# Altium project BlueSat_FlatSat.PrjPCB (part 1 of 2)
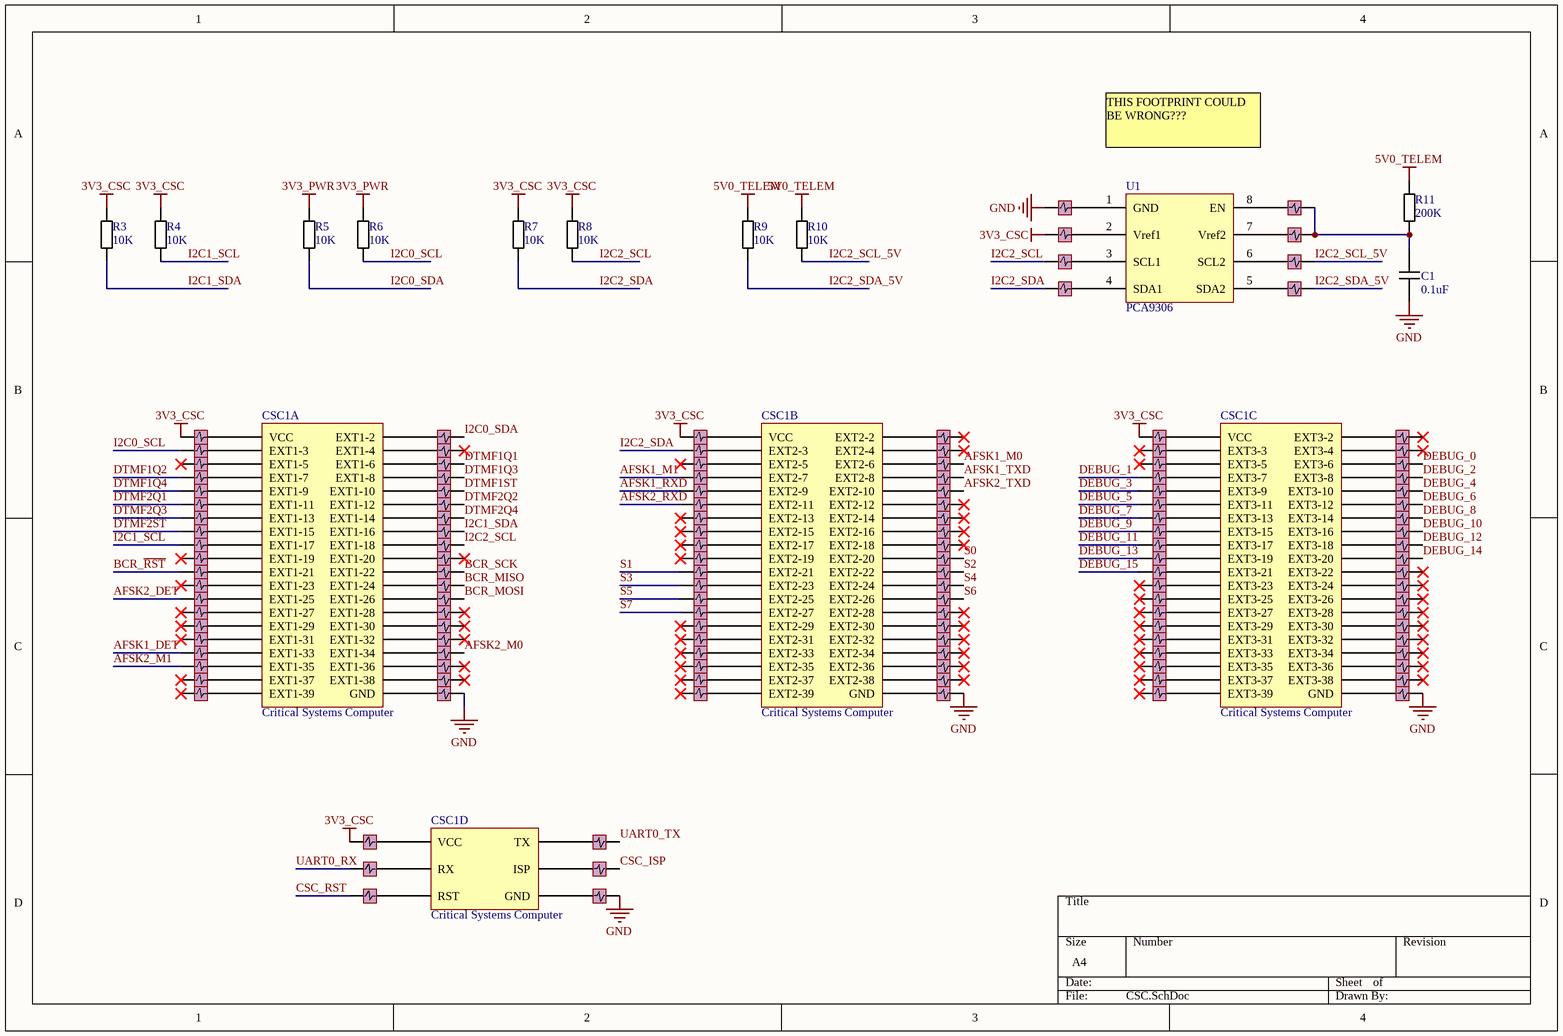
[diagram p0: CSC.SchDoc]
7 sheets, 787 parts. Net scope: global (net labels, ports and power ports of the same name join across sheets).
Board files: FLATSAT.PcbDoc, CSC_TEMP.PcbDoc, BBONE_TEMP.PcbDoc, COMMS_TEMP.PcbDoc, PWR_REG_TEMP.PcbDoc, PWR_GEN_TEMP.PcbDoc, LAYOUT_TEMP.PcbDoc
Sheets:
  CSC.SchDoc
  BBONE.SchDoc
  COMMS.SchDoc
  PWR_GEN.SchDoc
  PWR_REG.SchDoc
  CONNECTORS.SchDoc
  LED_INDICATORS.SchDoc

## Sheet CSC.SchDoc
size A4; DocumentNumber: 1; SheetNumber: 1; SheetTotal: 6

### Parts
C1  value 0.1uF  [6-0805_M]  (hidden comment: 0805 Cap)
CSC1  Critical Systems Computer  [CSC]  (parts A,B,C,D of 4)
P203  Jumper_Filter  [Jumper_filter]  (value not drawn)
P204  Jumper_Filter  [Jumper_filter]  (value not drawn)
P205  Jumper_Filter  [Jumper_filter]  (value not drawn)
P206  Jumper_Filter  [Jumper_filter]  (value not drawn)
P207  Jumper_Filter  [Jumper_filter]  (value not drawn)
P208  Jumper_Filter  [Jumper_filter]  (value not drawn)
P209  Jumper_Filter  [Jumper_filter]  (value not drawn)
P210  Jumper_Filter  [Jumper_filter]  (value not drawn)
P211  Jumper_Filter  [Jumper_filter]  (value not drawn)
P212  Jumper_Filter  [Jumper_filter]  (value not drawn)
P213  Jumper_Filter  [Jumper_filter]  (value not drawn)
P214  Jumper_Filter  [Jumper_filter]  (value not drawn)
P215  Jumper_Filter  [Jumper_filter]  (value not drawn)
P216  Jumper_Filter  [Jumper_filter]  (value not drawn)
P217  Jumper_Filter  [Jumper_filter]  (value not drawn)
P218  Jumper_Filter  [Jumper_filter]  (value not drawn)
P219  Jumper_Filter  [Jumper_filter]  (value not drawn)
P220  Jumper_Filter  [Jumper_filter]  (value not drawn)
P221  Jumper_Filter  [Jumper_filter]  (value not drawn)
P222  Jumper_Filter  [Jumper_filter]  (value not drawn)
P223  Jumper_Filter  [Jumper_filter]  (value not drawn)
P224  Jumper_Filter  [Jumper_filter]  (value not drawn)
P225  Jumper_Filter  [Jumper_filter]  (value not drawn)
P226  Jumper_Filter  [Jumper_filter]  (value not drawn)
P227  Jumper_Filter  [Jumper_filter]  (value not drawn)
P228  Jumper_Filter  [Jumper_filter]  (value not drawn)
P229  Jumper_Filter  [Jumper_filter]  (value not drawn)
P230  Jumper_Filter  [Jumper_filter]  (value not drawn)
P231  Jumper_Filter  [Jumper_filter]  (value not drawn)
P232  Jumper_Filter  [Jumper_filter]  (value not drawn)
P233  Jumper_Filter  [Jumper_filter]  (value not drawn)
P234  Jumper_Filter  [Jumper_filter]  (value not drawn)
P235  Jumper_Filter  [Jumper_filter]  (value not drawn)
P236  Jumper_Filter  [Jumper_filter]  (value not drawn)
P237  Jumper_Filter  [Jumper_filter]  (value not drawn)
P238  Jumper_Filter  [Jumper_filter]  (value not drawn)
P239  Jumper_Filter  [Jumper_filter]  (value not drawn)
P240  Jumper_Filter  [Jumper_filter]  (value not drawn)
P241  Jumper_Filter  [Jumper_filter]  (value not drawn)
P242  Jumper_Filter  [Jumper_filter]  (value not drawn)
P243  Jumper_Filter  [Jumper_filter]  (value not drawn)
P244  Jumper_Filter  [Jumper_filter]  (value not drawn)
P245  Jumper_Filter  [Jumper_filter]  (value not drawn)
P246  Jumper_Filter  [Jumper_filter]  (value not drawn)
P247  Jumper_Filter  [Jumper_filter]  (value not drawn)
P248  Jumper_Filter  [Jumper_filter]  (value not drawn)
P249  Jumper_Filter  [Jumper_filter]  (value not drawn)
P250  Jumper_Filter  [Jumper_filter]  (value not drawn)
P251  Jumper_Filter  [Jumper_filter]  (value not drawn)
P252  Jumper_Filter  [Jumper_filter]  (value not drawn)
P253  Jumper_Filter  [Jumper_filter]  (value not drawn)
P254  Jumper_Filter  [Jumper_filter]  (value not drawn)
P255  Jumper_Filter  [Jumper_filter]  (value not drawn)
P256  Jumper_Filter  [Jumper_filter]  (value not drawn)
P257  Jumper_Filter  [Jumper_filter]  (value not drawn)
P258  Jumper_Filter  [Jumper_filter]  (value not drawn)
P259  Jumper_Filter  [Jumper_filter]  (value not drawn)
P260  Jumper_Filter  [Jumper_filter]  (value not drawn)
P261  Jumper_Filter  [Jumper_filter]  (value not drawn)
P262  Jumper_Filter  [Jumper_filter]  (value not drawn)
P263  Jumper_Filter  [Jumper_filter]  (value not drawn)
P264  Jumper_Filter  [Jumper_filter]  (value not drawn)
P265  Jumper_Filter  [Jumper_filter]  (value not drawn)
P266  Jumper_Filter  [Jumper_filter]  (value not drawn)
P267  Jumper_Filter  [Jumper_filter]  (value not drawn)
P268  Jumper_Filter  [Jumper_filter]  (value not drawn)
P269  Jumper_Filter  [Jumper_filter]  (value not drawn)
P270  Jumper_Filter  [Jumper_filter]  (value not drawn)
P271  Jumper_Filter  [Jumper_filter]  (value not drawn)
P272  Jumper_Filter  [Jumper_filter]  (value not drawn)
P273  Jumper_Filter  [Jumper_filter]  (value not drawn)
P274  Jumper_Filter  [Jumper_filter]  (value not drawn)
P275  Jumper_Filter  [Jumper_filter]  (value not drawn)
P276  Jumper_Filter  [Jumper_filter]  (value not drawn)
P277  Jumper_Filter  [Jumper_filter]  (value not drawn)
P278  Jumper_Filter  [Jumper_filter]  (value not drawn)
P279  Jumper_Filter  [Jumper_filter]  (value not drawn)
P280  Jumper_Filter  [Jumper_filter]  (value not drawn)
P281  Jumper_Filter  [Jumper_filter]  (value not drawn)
P282  Jumper_Filter  [Jumper_filter]  (value not drawn)
P283  Jumper_Filter  [Jumper_filter]  (value not drawn)
P284  Jumper_Filter  [Jumper_filter]  (value not drawn)
P285  Jumper_Filter  [Jumper_filter]  (value not drawn)
P286  Jumper_Filter  [Jumper_filter]  (value not drawn)
P287  Jumper_Filter  [Jumper_filter]  (value not drawn)
P288  Jumper_Filter  [Jumper_filter]  (value not drawn)
P289  Jumper_Filter  [Jumper_filter]  (value not drawn)
P290  Jumper_Filter  [Jumper_filter]  (value not drawn)
P291  Jumper_Filter  [Jumper_filter]  (value not drawn)
P292  Jumper_Filter  [Jumper_filter]  (value not drawn)
P293  Jumper_Filter  [Jumper_filter]  (value not drawn)
P294  Jumper_Filter  [Jumper_filter]  (value not drawn)
P295  Jumper_Filter  [Jumper_filter]  (value not drawn)
P296  Jumper_Filter  [Jumper_filter]  (value not drawn)
P297  Jumper_Filter  [Jumper_filter]  (value not drawn)
P298  Jumper_Filter  [Jumper_filter]  (value not drawn)
P299  Jumper_Filter  [Jumper_filter]  (value not drawn)
P300  Jumper_Filter  [Jumper_filter]  (value not drawn)
P301  Jumper_Filter  [Jumper_filter]  (value not drawn)
P302  Jumper_Filter  [Jumper_filter]  (value not drawn)
P303  Jumper_Filter  [Jumper_filter]  (value not drawn)
P304  Jumper_Filter  [Jumper_filter]  (value not drawn)
P305  Jumper_Filter  [Jumper_filter]  (value not drawn)
P306  Jumper_Filter  [Jumper_filter]  (value not drawn)
P307  Jumper_Filter  [Jumper_filter]  (value not drawn)
P308  Jumper_Filter  [Jumper_filter]  (value not drawn)
P309  Jumper_Filter  [Jumper_filter]  (value not drawn)
P310  Jumper_Filter  [Jumper_filter]  (value not drawn)
P311  Jumper_Filter  [Jumper_filter]  (value not drawn)
P312  Jumper_Filter  [Jumper_filter]  (value not drawn)
P313  Jumper_Filter  [Jumper_filter]  (value not drawn)
P314  Jumper_Filter  [Jumper_filter]  (value not drawn)
P315  Jumper_Filter  [Jumper_filter]  (value not drawn)
P316  Jumper_Filter  [Jumper_filter]  (value not drawn)
P317  Jumper_Filter  [Jumper_filter]  (value not drawn)
P318  Jumper_Filter  [Jumper_filter]  (value not drawn)
P319  Jumper_Filter  [Jumper_filter]  (value not drawn)
P320  Jumper_Filter  [Jumper_filter]  (value not drawn)
P321  Jumper_Filter  [Jumper_filter]  (value not drawn)
P322  Jumper_Filter  [Jumper_filter]  (value not drawn)
P323  Jumper_Filter  [Jumper_filter]  (value not drawn)
P324  Jumper_Filter  [Jumper_filter]  (value not drawn)
P325  Jumper_Filter  [Jumper_filter]  (value not drawn)
P326  Jumper_Filter  [Jumper_filter]  (value not drawn)
P327  Jumper_Filter  [Jumper_filter]  (value not drawn)
P328  Jumper_Filter  [Jumper_filter]  (value not drawn)
P329  Jumper_Filter  [Jumper_filter]  (value not drawn)
P330  Jumper_Filter  [Jumper_filter]  (value not drawn)
P331  Jumper_Filter  [Jumper_filter]  (value not drawn)
P332  Jumper_Filter  [Jumper_filter]  (value not drawn)
P333  Jumper_Filter  [Jumper_filter]  (value not drawn)
P334  Jumper_Filter  [Jumper_filter]  (value not drawn)
P335  Jumper_Filter  [Jumper_filter]  (value not drawn)
P336  Jumper_Filter  [Jumper_filter]  (value not drawn)
R3  value 10K  [6-0805_M]  (hidden comment: 1206 Resistor)
R4  value 10K  [6-0805_M]  (hidden comment: 1206 Resistor)
R5  value 10K  [6-0805_M]  (hidden comment: 1206 Resistor)
R6  value 10K  [6-0805_M]  (hidden comment: 1206 Resistor)
R7  value 10K  [6-0805_M]  (hidden comment: 1206 Resistor)
R8  value 10K  [6-0805_M]  (hidden comment: 1206 Resistor)
R9  value 10K  [6-0805_M]  (hidden comment: 1206 Resistor)
R10  value 10K  [6-0805_M]  (hidden comment: 1206 Resistor)
R11  value 200K  [6-0805_M]  (hidden comment: 1206 Resistor)
U1  PCA9306  [TSSOP50P310X90-8N]

### Nets
3V3_CSC: P203.1 P223.1 P249.1 P290.1 P293.1 R3.1 R4.1 R7.1 R8.1
3V3_PWR: R5.1 R6.1
5V0_TELEM: R9.1 R10.1 R11.1
GND: C1.1 P203.3 P204.3 P205.3 P206.3 P207.3 P208.3 P209.3 P210.3 P211.3 P212.3 P213.3 P214.3 P215.3 P216.3 P217.3 P218.3 P219.3 P220.3 P221.3 P222.3 P223.3 P224.3 P225.3 P226.3 P227.3 P228.3 P229.3 P230.3 P231.3 P232.3 P233.3 P234.3 P235.3 P236.3 P237.3 P238.3 P239.3 P240.3 P241.3 P242.3 P243.3 P244.3 P245.1 P245.3 P246.3 P247.3 P248.1 P248.3 P249.3 P250.3 P251.3 P252.3 P253.3 P254.3 P255.3 P256.3 P257.3 P258.3 P259.3 P260.3 P261.3 P262.3 P263.3 P264.3 P265.3 P266.3 P267.3 P268.3 P269.3 P270.3 P271.3 P272.3 P273.3 P274.3 P275.3 P276.3 P277.3 P278.3 P279.3 P280.3 P281.3 P282.3 P283.3 P284.3 P285.3 P286.3 P287.3 P288.1 P288.3 P289.1 P289.3 P290.3 P291.3 P292.3 P293.3 P294.3 P295.3 P296.3 P297.3 P298.3 P299.3 P300.3 P301.3 P302.3 P303.3 P304.3 P305.3 P306.3 P307.3 P308.3 P309.3 P310.3 P311.3 P312.3 P313.3 P314.3 P315.3 P316.3 P317.3 P318.3 P319.3 P320.3 P321.3 P322.3 P323.3 P324.3 P325.3 P326.3 P327.3 P328.3 P329.3 P330.3 P331.3 P332.3 P333.3 P334.3 P335.3 P336.1 P336.3
AFSK1_DET: P219.1
AFSK1_M0: P271.1
AFSK1_M1: P252.1
AFSK1_RXD: P253.1
AFSK1_TXD: P272.1
AFSK2_DET: P215.1
AFSK2_M0: P242.1
AFSK2_M1: P220.1
AFSK2_RXD: P254.1
AFSK2_TXD: P273.1
BCR_MISO: P237.1
BCR_MOSI: P238.1
BCR_~{RST}: P213.1
BCR_SCK: P236.1
CSC_ISP: P247.1
CSC_RST: P225.1
DEBUG_0: P319.1
DEBUG_1: P296.1
DEBUG_2: P320.1
DEBUG_3: P297.1
DEBUG_4: P321.1
DEBUG_5: P298.1
DEBUG_6: P322.1
DEBUG_7: P299.1
DEBUG_8: P323.1
DEBUG_9: P300.1
DEBUG_10: P324.1
DEBUG_11: P301.1
DEBUG_12: P325.1
DEBUG_13: P302.1
DEBUG_14: P326.1
DEBUG_15: P303.1
DTMF1Q1: P228.1
DTMF1Q2: P206.1
DTMF1Q3: P229.1
DTMF1Q4: P207.1
DTMF1ST: P230.1
DTMF2Q1: P208.1
DTMF2Q2: P231.1
DTMF2Q3: P209.1
DTMF2Q4: P232.1
DTMF2ST: P210.1
I2C0_SCL: P204.1 R6.2
I2C0_SDA: P226.1 R5.2
I2C1_SCL: P211.1 R4.2
I2C1_SDA: P233.1 R3.2
I2C2_SCL: P234.1 P291.1 R8.2
I2C2_SCL_5V: P315.1 R10.2
I2C2_SDA: P250.1 P292.1 R7.2
I2C2_SDA_5V: P316.1 R9.2
S0: P278.1
S1: P259.1
S2: P279.1
S3: P260.1
S4: P280.1
S5: P261.1
S6: P281.1
S7: P262.1
UART0_RX: P224.1
UART0_TX: P246.1
NetC1_2: C1.2 P313.1 P314.1 R11.2
NetCSC1_C1_1: CSC1.C1_1(VCC) P203.2
NetCSC1_C1_2: CSC1.C1_2(EXT1-2) P226.2
NetCSC1_C1_3: CSC1.C1_3(EXT1-3) P204.2
NetCSC1_C1_4: CSC1.C1_4(EXT1-4) P227.2
NetCSC1_C1_5: CSC1.C1_5(EXT1-5) P205.2
NetCSC1_C1_6: CSC1.C1_6(EXT1-6) P228.2
NetCSC1_C1_7: CSC1.C1_7(EXT1-7) P206.2
NetCSC1_C1_8: CSC1.C1_8(EXT1-8) P229.2
NetCSC1_C1_9: CSC1.C1_9(EXT1-9) P207.2
NetCSC1_C1_10: CSC1.C1_10(EXT1-10) P230.2
NetCSC1_C1_11: CSC1.C1_11(EXT1-11) P208.2
NetCSC1_C1_12: CSC1.C1_12(EXT1-12) P231.2
NetCSC1_C1_13: CSC1.C1_13(EXT1-13) P209.2
NetCSC1_C1_14: CSC1.C1_14(EXT1-14) P232.2
NetCSC1_C1_15: CSC1.C1_15(EXT1-15) P210.2
NetCSC1_C1_16: CSC1.C1_16(EXT1-16) P233.2
NetCSC1_C1_17: CSC1.C1_17(EXT1-17) P211.2
NetCSC1_C1_18: CSC1.C1_18(EXT1-18) P234.2
NetCSC1_C1_19: CSC1.C1_19(EXT1-19) P212.2
NetCSC1_C1_20: CSC1.C1_20(EXT1-20) P235.2
NetCSC1_C1_21: CSC1.C1_21(EXT1-21) P213.2
NetCSC1_C1_22: CSC1.C1_22(EXT1-22) P236.2
NetCSC1_C1_23: CSC1.C1_23(EXT1-23) P214.2
NetCSC1_C1_24: CSC1.C1_24(EXT1-24) P237.2
NetCSC1_C1_25: CSC1.C1_25(EXT1-25) P215.2
NetCSC1_C1_26: CSC1.C1_26(EXT1-26) P238.2
NetCSC1_C1_27: CSC1.C1_27(EXT1-27) P216.2
NetCSC1_C1_28: CSC1.C1_28(EXT1-28) P239.2
NetCSC1_C1_29: CSC1.C1_29(EXT1-29) P217.2
NetCSC1_C1_30: CSC1.C1_30(EXT1-30) P240.2
NetCSC1_C1_31: CSC1.C1_31(EXT1-31) P218.2
NetCSC1_C1_32: CSC1.C1_32(EXT1-32) P241.2
NetCSC1_C1_33: CSC1.C1_33(EXT1-33) P219.2
NetCSC1_C1_34: CSC1.C1_34(EXT1-34) P242.2
NetCSC1_C1_35: CSC1.C1_35(EXT1-35) P220.2
NetCSC1_C1_36: CSC1.C1_36(EXT1-36) P243.2
NetCSC1_C1_37: CSC1.C1_37(EXT1-37) P221.2
NetCSC1_C1_38: CSC1.C1_38(EXT1-38) P244.2
NetCSC1_C1_39: CSC1.C1_39(EXT1-39) P222.2
NetCSC1_C1_40: CSC1.C1_40(GND) P245.2
NetCSC1_C2_1: CSC1.C2_1(VCC) P249.2
NetCSC1_C2_2: CSC1.C2_2(EXT2-2) P269.2
NetCSC1_C2_3: CSC1.C2_3(EXT2-3) P250.2
NetCSC1_C2_4: CSC1.C2_4(EXT2-4) P270.2
NetCSC1_C2_5: CSC1.C2_5(EXT2-5) P251.2
NetCSC1_C2_6: CSC1.C2_6(EXT2-6) P271.2
NetCSC1_C2_7: CSC1.C2_7(EXT2-7) P252.2
NetCSC1_C2_8: CSC1.C2_8(EXT2-8) P272.2
NetCSC1_C2_9: CSC1.C2_9(EXT2-9) P253.2
NetCSC1_C2_10: CSC1.C2_10(EXT2-10) P273.2
NetCSC1_C2_11: CSC1.C2_11(EXT2-11) P254.2
NetCSC1_C2_12: CSC1.C2_12(EXT2-12) P274.2
NetCSC1_C2_13: CSC1.C2_13(EXT2-13) P255.2
NetCSC1_C2_14: CSC1.C2_14(EXT2-14) P275.2
NetCSC1_C2_15: CSC1.C2_15(EXT2-15) P256.2
NetCSC1_C2_16: CSC1.C2_16(EXT2-16) P276.2
NetCSC1_C2_17: CSC1.C2_17(EXT2-17) P257.2
NetCSC1_C2_18: CSC1.C2_18(EXT2-18) P277.2
NetCSC1_C2_19: CSC1.C2_19(EXT2-19) P258.2
NetCSC1_C2_20: CSC1.C2_20(EXT2-20) P278.2
NetCSC1_C2_21: CSC1.C2_21(EXT2-21) P259.2
NetCSC1_C2_22: CSC1.C2_22(EXT2-22) P279.2
NetCSC1_C2_23: CSC1.C2_23(EXT2-23) P260.2
NetCSC1_C2_24: CSC1.C2_24(EXT2-24) P280.2
NetCSC1_C2_25: CSC1.C2_25(EXT2-25) P261.2
NetCSC1_C2_26: CSC1.C2_26(EXT2-26) P281.2
NetCSC1_C2_27: CSC1.C2_27(EXT2-27) P262.2
NetCSC1_C2_28: CSC1.C2_28(EXT2-28) P282.2
NetCSC1_C2_29: CSC1.C2_29(EXT2-29) P263.2
NetCSC1_C2_30: CSC1.C2_30(EXT2-30) P283.2
NetCSC1_C2_31: CSC1.C2_31(EXT2-31) P264.2
NetCSC1_C2_32: CSC1.C2_32(EXT2-32) P284.2
NetCSC1_C2_33: CSC1.C2_33(EXT2-33) P265.2
NetCSC1_C2_34: CSC1.C2_34(EXT2-34) P285.2
NetCSC1_C2_35: CSC1.C2_35(EXT2-35) P266.2
NetCSC1_C2_36: CSC1.C2_36(EXT2-36) P286.2
NetCSC1_C2_37: CSC1.C2_37(EXT2-37) P267.2
NetCSC1_C2_38: CSC1.C2_38(EXT2-38) P287.2
NetCSC1_C2_39: CSC1.C2_39(EXT2-39) P268.2
NetCSC1_C2_40: CSC1.C2_40(GND) P288.2
NetCSC1_C3_1: CSC1.C3_1(VCC) P293.2
NetCSC1_C3_2: CSC1.C3_2(EXT3-2) P317.2
NetCSC1_C3_3: CSC1.C3_3(EXT3-3) P294.2
NetCSC1_C3_4: CSC1.C3_4(EXT3-4) P318.2
NetCSC1_C3_5: CSC1.C3_5(EXT3-5) P295.2
NetCSC1_C3_6: CSC1.C3_6(EXT3-6) P319.2
NetCSC1_C3_7: CSC1.C3_7(EXT3-7) P296.2
NetCSC1_C3_8: CSC1.C3_8(EXT3-8) P320.2
NetCSC1_C3_9: CSC1.C3_9(EXT3-9) P297.2
NetCSC1_C3_10: CSC1.C3_10(EXT3-10) P321.2
NetCSC1_C3_11: CSC1.C3_11(EXT3-11) P298.2
NetCSC1_C3_12: CSC1.C3_12(EXT3-12) P322.2
NetCSC1_C3_13: CSC1.C3_13(EXT3-13) P299.2
NetCSC1_C3_14: CSC1.C3_14(EXT3-14) P323.2
NetCSC1_C3_15: CSC1.C3_15(EXT3-15) P300.2
NetCSC1_C3_16: CSC1.C3_16(EXT3-16) P324.2
NetCSC1_C3_17: CSC1.C3_17(EXT3-17) P301.2
NetCSC1_C3_18: CSC1.C3_18(EXT3-18) P325.2
NetCSC1_C3_19: CSC1.C3_19(EXT3-19) P302.2
NetCSC1_C3_20: CSC1.C3_20(EXT3-20) P326.2
NetCSC1_C3_21: CSC1.C3_21(EXT3-21) P303.2
NetCSC1_C3_22: CSC1.C3_22(EXT3-22) P327.2
NetCSC1_C3_23: CSC1.C3_23(EXT3-23) P304.2
NetCSC1_C3_24: CSC1.C3_24(EXT3-24) P328.2
NetCSC1_C3_25: CSC1.C3_25(EXT3-25) P305.2
NetCSC1_C3_26: CSC1.C3_26(EXT3-26) P329.2
NetCSC1_C3_27: CSC1.C3_27(EXT3-27) P306.2
NetCSC1_C3_28: CSC1.C3_28(EXT3-28) P330.2
NetCSC1_C3_29: CSC1.C3_29(EXT3-29) P307.2
NetCSC1_C3_30: CSC1.C3_30(EXT3-30) P331.2
NetCSC1_C3_31: CSC1.C3_31(EXT3-31) P308.2
NetCSC1_C3_32: CSC1.C3_32(EXT3-32) P332.2
NetCSC1_C3_33: CSC1.C3_33(EXT3-33) P309.2
NetCSC1_C3_34: CSC1.C3_34(EXT3-34) P333.2
NetCSC1_C3_35: CSC1.C3_35(EXT3-35) P310.2
NetCSC1_C3_36: CSC1.C3_36(EXT3-36) P334.2
NetCSC1_C3_37: CSC1.C3_37(EXT3-37) P311.2
NetCSC1_C3_38: CSC1.C3_38(EXT3-38) P335.2
NetCSC1_C3_39: CSC1.C3_39(EXT3-39) P312.2
NetCSC1_C3_40: CSC1.C3_40(GND) P336.2
NetCSC1_ISP1: CSC1.ISP1(VCC) P223.2
NetCSC1_ISP2: CSC1.ISP2(RX) P224.2
NetCSC1_ISP3: CSC1.ISP3(RST) P225.2
NetCSC1_ISP4: CSC1.ISP4(TX) P246.2
NetCSC1_ISP5: CSC1.ISP5(ISP) P247.2
NetCSC1_ISP6: CSC1.ISP6(GND) P248.2
NetP289_2: P289.2 U1.1(GND)
NetP290_2: P290.2 U1.2(Vref1)
NetP291_2: P291.2 U1.3(SCL1)
NetP292_2: P292.2 U1.4(SDA1)
NetP313_2: P313.2 U1.8(EN)
NetP314_2: P314.2 U1.7(Vref2)
NetP315_2: P315.2 U1.6(SCL2)
NetP316_2: P316.2 U1.5(SDA2)

Not connected (* = marked no-connect by the designer): P205 1*; P212 1*; P214 1*; P216 1*; P217 1*; P218 1*; P221 1*; P222 1*; P227 1*; P235 1*; P239 1*; P240 1*; P241 1*; P243 1*; P244 1*; P251 1*; P255 1*; P256 1*; P257 1*; P258 1*; P263 1*; P264 1*; P265 1*; P266 1*; P267 1*; P268 1*; P269 1*; P270 1*; P274 1*; P275 1*; P276 1*; P277 1*; P282 1*; P283 1*; P284 1*; P285 1*; P286 1*; P287 1*; P294 1*; P295 1*; P304 1*; P305 1*; P306 1*; P307 1*; P308 1*; P309 1*; P310 1*; P311 1*; P312 1*; P317 1*; P318 1*; P327 1*; P328 1*; P329 1*; P330 1*; P331 1*; P332 1*; P333 1*; P334 1*; P335 1*

### Notes on the sheet
- THIS FOOTPRINT COULD BE WRONG???

### Library data of the parts
C1 = 0805 MLCC - X7R, 10%
CSC1 = CSC
R3-R11 = 1206 Thick Film Resistor 1%

## Sheet BBONE.SchDoc
size A4; DocumentNumber: 1; SheetNumber: 2; SheetTotal: 6
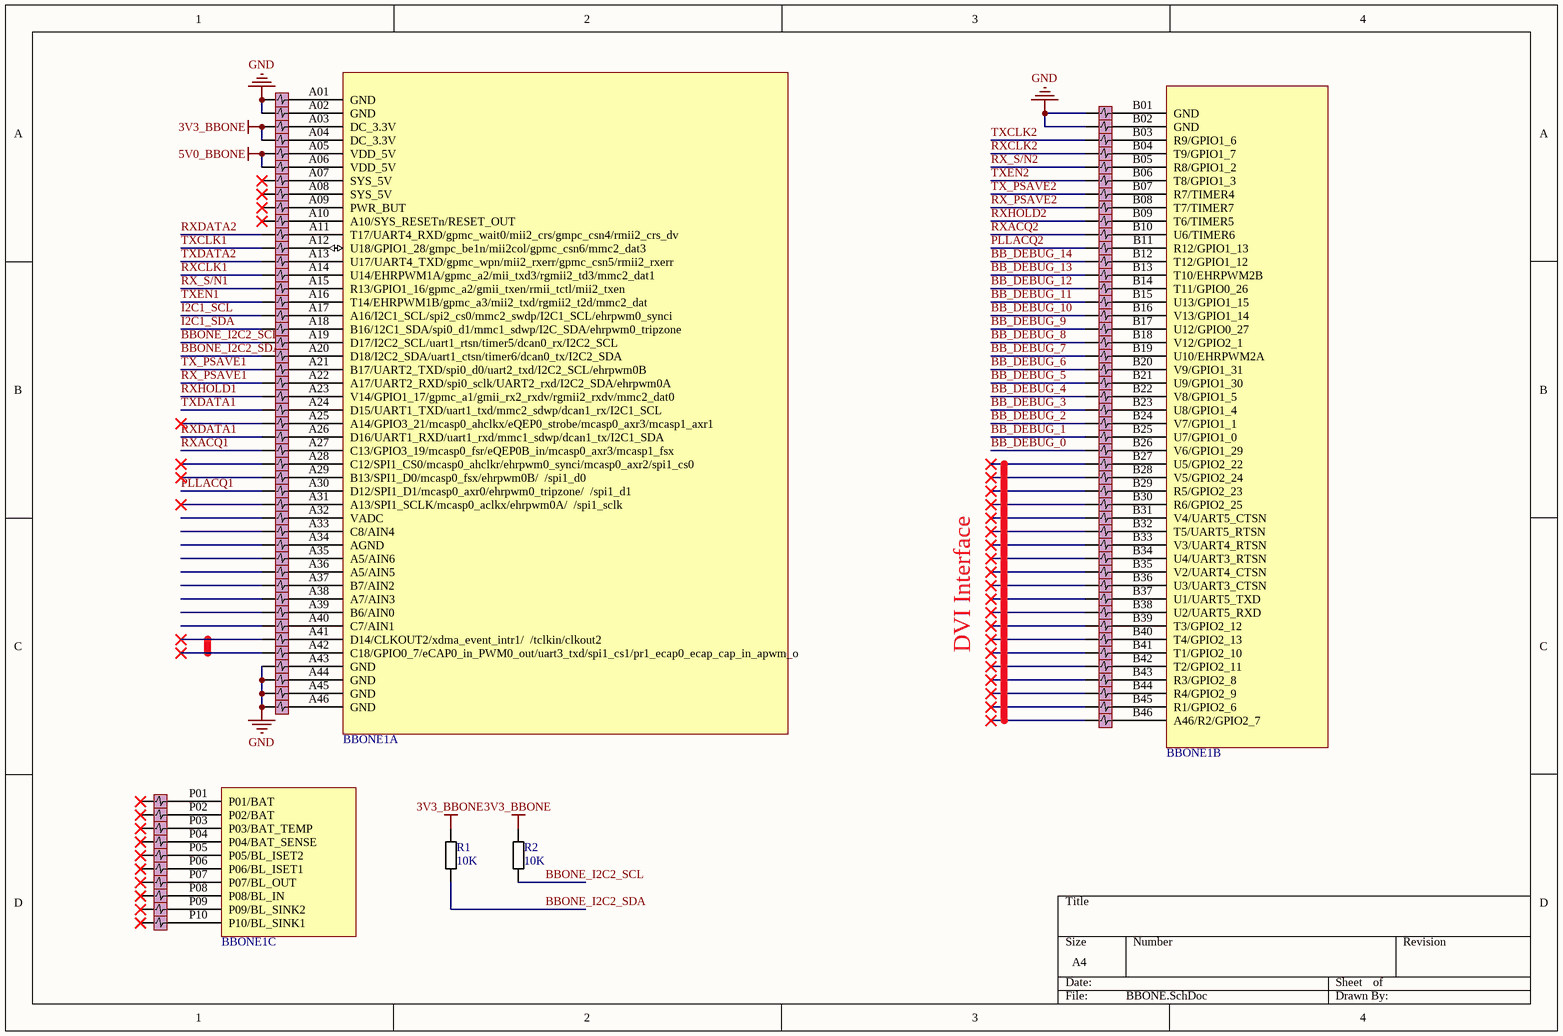
[diagram p1: BBONE.SchDoc]

### Parts
BBONE1  Beagle_Bone  [Beaglebone]  (value not drawn)  (parts A,B,C of 3)
P1  Jumper_Filter  [Jumper_filter]  (value not drawn)
P2  Jumper_Filter  [Jumper_filter]  (value not drawn)
P3  Jumper_Filter  [Jumper_filter]  (value not drawn)
P4  Jumper_Filter  [Jumper_filter]  (value not drawn)
P5  Jumper_Filter  [Jumper_filter]  (value not drawn)
P6  Jumper_Filter  [Jumper_filter]  (value not drawn)
P7  Jumper_Filter  [Jumper_filter]  (value not drawn)
P8  Jumper_Filter  [Jumper_filter]  (value not drawn)
P9  Jumper_Filter  [Jumper_filter]  (value not drawn)
P10  Jumper_Filter  [Jumper_filter]  (value not drawn)
P11  Jumper_Filter  [Jumper_filter]  (value not drawn)
P12  Jumper_Filter  [Jumper_filter]  (value not drawn)
P13  Jumper_Filter  [Jumper_filter]  (value not drawn)
P14  Jumper_Filter  [Jumper_filter]  (value not drawn)
P15  Jumper_Filter  [Jumper_filter]  (value not drawn)
P16  Jumper_Filter  [Jumper_filter]  (value not drawn)
P17  Jumper_Filter  [Jumper_filter]  (value not drawn)
P18  Jumper_Filter  [Jumper_filter]  (value not drawn)
P19  Jumper_Filter  [Jumper_filter]  (value not drawn)
P20  Jumper_Filter  [Jumper_filter]  (value not drawn)
P21  Jumper_Filter  [Jumper_filter]  (value not drawn)
P22  Jumper_Filter  [Jumper_filter]  (value not drawn)
P23  Jumper_Filter  [Jumper_filter]  (value not drawn)
P24  Jumper_Filter  [Jumper_filter]  (value not drawn)
P25  Jumper_Filter  [Jumper_filter]  (value not drawn)
P26  Jumper_Filter  [Jumper_filter]  (value not drawn)
P27  Jumper_Filter  [Jumper_filter]  (value not drawn)
P28  Jumper_Filter  [Jumper_filter]  (value not drawn)
P29  Jumper_Filter  [Jumper_filter]  (value not drawn)
P30  Jumper_Filter  [Jumper_filter]  (value not drawn)
P31  Jumper_Filter  [Jumper_filter]  (value not drawn)
P32  Jumper_Filter  [Jumper_filter]  (value not drawn)
P33  Jumper_Filter  [Jumper_filter]  (value not drawn)
P34  Jumper_Filter  [Jumper_filter]  (value not drawn)
P35  Jumper_Filter  [Jumper_filter]  (value not drawn)
P36  Jumper_Filter  [Jumper_filter]  (value not drawn)
P37  Jumper_Filter  [Jumper_filter]  (value not drawn)
P38  Jumper_Filter  [Jumper_filter]  (value not drawn)
P39  Jumper_Filter  [Jumper_filter]  (value not drawn)
P40  Jumper_Filter  [Jumper_filter]  (value not drawn)
P41  Jumper_Filter  [Jumper_filter]  (value not drawn)
P42  Jumper_Filter  [Jumper_filter]  (value not drawn)
P43  Jumper_Filter  [Jumper_filter]  (value not drawn)
P44  Jumper_Filter  [Jumper_filter]  (value not drawn)
P45  Jumper_Filter  [Jumper_filter]  (value not drawn)
P46  Jumper_Filter  [Jumper_filter]  (value not drawn)
P47  Jumper_Filter  [Jumper_filter]  (value not drawn)
P48  Jumper_Filter  [Jumper_filter]  (value not drawn)
P49  Jumper_Filter  [Jumper_filter]  (value not drawn)
P50  Jumper_Filter  [Jumper_filter]  (value not drawn)
P51  Jumper_Filter  [Jumper_filter]  (value not drawn)
P52  Jumper_Filter  [Jumper_filter]  (value not drawn)
P53  Jumper_Filter  [Jumper_filter]  (value not drawn)
P54  Jumper_Filter  [Jumper_filter]  (value not drawn)
P55  Jumper_Filter  [Jumper_filter]  (value not drawn)
P56  Jumper_Filter  [Jumper_filter]  (value not drawn)
P57  Jumper_Filter  [Jumper_filter]  (value not drawn)
P58  Jumper_Filter  [Jumper_filter]  (value not drawn)
P59  Jumper_Filter  [Jumper_filter]  (value not drawn)
P60  Jumper_Filter  [Jumper_filter]  (value not drawn)
P61  Jumper_Filter  [Jumper_filter]  (value not drawn)
P62  Jumper_Filter  [Jumper_filter]  (value not drawn)
P63  Jumper_Filter  [Jumper_filter]  (value not drawn)
P64  Jumper_Filter  [Jumper_filter]  (value not drawn)
P65  Jumper_Filter  [Jumper_filter]  (value not drawn)
P66  Jumper_Filter  [Jumper_filter]  (value not drawn)
P67  Jumper_Filter  [Jumper_filter]  (value not drawn)
P68  Jumper_Filter  [Jumper_filter]  (value not drawn)
P69  Jumper_Filter  [Jumper_filter]  (value not drawn)
P70  Jumper_Filter  [Jumper_filter]  (value not drawn)
P71  Jumper_Filter  [Jumper_filter]  (value not drawn)
P72  Jumper_Filter  [Jumper_filter]  (value not drawn)
P73  Jumper_Filter  [Jumper_filter]  (value not drawn)
P74  Jumper_Filter  [Jumper_filter]  (value not drawn)
P75  Jumper_Filter  [Jumper_filter]  (value not drawn)
P76  Jumper_Filter  [Jumper_filter]  (value not drawn)
P77  Jumper_Filter  [Jumper_filter]  (value not drawn)
P78  Jumper_Filter  [Jumper_filter]  (value not drawn)
P79  Jumper_Filter  [Jumper_filter]  (value not drawn)
P80  Jumper_Filter  [Jumper_filter]  (value not drawn)
P81  Jumper_Filter  [Jumper_filter]  (value not drawn)
P82  Jumper_Filter  [Jumper_filter]  (value not drawn)
P83  Jumper_Filter  [Jumper_filter]  (value not drawn)
P84  Jumper_Filter  [Jumper_filter]  (value not drawn)
P85  Jumper_Filter  [Jumper_filter]  (value not drawn)
P86  Jumper_Filter  [Jumper_filter]  (value not drawn)
P87  Jumper_Filter  [Jumper_filter]  (value not drawn)
P88  Jumper_Filter  [Jumper_filter]  (value not drawn)
P89  Jumper_Filter  [Jumper_filter]  (value not drawn)
P90  Jumper_Filter  [Jumper_filter]  (value not drawn)
P91  Jumper_Filter  [Jumper_filter]  (value not drawn)
P92  Jumper_Filter  [Jumper_filter]  (value not drawn)
P93  Jumper_Filter  [Jumper_filter]  (value not drawn)
P94  Jumper_Filter  [Jumper_filter]  (value not drawn)
P95  Jumper_Filter  [Jumper_filter]  (value not drawn)
P96  Jumper_Filter  [Jumper_filter]  (value not drawn)
P97  Jumper_Filter  [Jumper_filter]  (value not drawn)
P98  Jumper_Filter  [Jumper_filter]  (value not drawn)
P99  Jumper_Filter  [Jumper_filter]  (value not drawn)
P100  Jumper_Filter  [Jumper_filter]  (value not drawn)
P101  Jumper_Filter  [Jumper_filter]  (value not drawn)
P102  Jumper_Filter  [Jumper_filter]  (value not drawn)
R1  value 10K  [6-0805_M]  (hidden comment: 1206 Resistor)
R2  value 10K  [6-0805_M]  (hidden comment: 1206 Resistor)

### Nets
3V3_BBONE: P3.1 P4.1 R1.1 R2.1
5V0_BBONE: P5.1 P6.1
GND: P1.1 P1.3 P2.1 P2.3 P3.3 P4.3 P5.3 P6.3 P7.3 P8.3 P9.3 P10.3 P11.3 P12.3 P13.3 P14.3 P15.3 P16.3 P17.3 P18.3 P19.3 P20.3 P21.3 P22.3 P23.3 P24.3 P25.3 P26.3 P27.3 P28.3 P29.3 P30.3 P31.3 P32.3 P33.3 P34.3 P35.3 P36.3 P37.3 P38.3 P39.3 P40.3 P41.3 P42.3 P43.1 P43.3 P44.1 P44.3 P45.1 P45.3 P46.1 P46.3 P47.1 P47.3 P48.1 P48.3 P49.3 P50.3 P51.3 P52.3 P53.3 P54.3 P55.3 P56.3 P57.3 P58.3 P59.3 P60.3 P61.3 P62.3 P63.3 P64.3 P65.3 P66.3 P67.3 P68.3 P69.3 P70.3 P71.3 P72.3 P73.3 P74.3 P75.3 P76.3 P77.3 P78.3 P79.3 P80.3 P81.3 P82.3 P83.3 P84.3 P85.3 P86.3 P87.3 P88.3 P89.3 P90.3 P91.3 P92.3 P93.3 P94.3 P95.3 P96.3 P97.3 P98.3 P99.3 P100.3 P101.3 P102.3
BB_DEBUG_0: P72.1
BB_DEBUG_1: P71.1
BB_DEBUG_2: P70.1
BB_DEBUG_3: P69.1
BB_DEBUG_4: P68.1
BB_DEBUG_5: P67.1
BB_DEBUG_6: P66.1
BB_DEBUG_7: P65.1
BB_DEBUG_8: P64.1
BB_DEBUG_9: P63.1
BB_DEBUG_10: P62.1
BB_DEBUG_11: P61.1
BB_DEBUG_12: P60.1
BB_DEBUG_13: P59.1
BB_DEBUG_14: P58.1
BBONE_I2C2_SCL: P19.1 R2.2
BBONE_I2C2_SDA: P20.1 R1.2
I2C1_SCL: P17.1
I2C1_SDA: P18.1
PLLACQ1: P30.1
PLLACQ2: P57.1
RX_PSAVE1: P22.1
RX_PSAVE2: P54.1
RX_S/N1: P15.1
RX_S/N2: P51.1
RXACQ1: P27.1
RXACQ2: P56.1
RXCLK1: P14.1
RXCLK2: P50.1
RXDATA1: P26.1
RXDATA2: P11.1
RXHOLD1: P23.1
RXHOLD2: P55.1
TX_PSAVE1: P21.1
TX_PSAVE2: P53.1
TXCLK1: P12.1
TXCLK2: P49.1
TXDATA1: P24.1
TXDATA2: P13.1
TXEN1: P16.1
TXEN2: P52.1
NetBBONE1_A01: BBONE1.A01(GND) P1.2
NetBBONE1_A02: BBONE1.A02(GND) P2.2
NetBBONE1_A03: BBONE1.A03(DC_3.3V) P3.2
NetBBONE1_A04: BBONE1.A04(DC_3.3V) P4.2
NetBBONE1_A05: BBONE1.A05(VDD_5V) P5.2
NetBBONE1_A06: BBONE1.A06(VDD_5V) P6.2
NetBBONE1_A07: BBONE1.A07(SYS_5V) P7.2
NetBBONE1_A08: BBONE1.A08(SYS_5V) P8.2
NetBBONE1_A09: BBONE1.A09(PWR_BUT) P9.2
NetBBONE1_A10: BBONE1.A10(A10/SYS_RESETn/RESET_OUT) P10.2
NetBBONE1_A11: BBONE1.A11(T17/UART4_RXD/gpmc_wait0/mii2_crs/gmpc_csn4/rmii2_crs_dv) P11.2
NetBBONE1_A12: BBONE1.A12(U18/GPIO1_28/gmpc_be1n/mii2col/gpmc_csn6/mmc2_dat3) P12.2
NetBBONE1_A13: BBONE1.A13(U17/UART4_TXD/gpmc_wpn/mii2_rxerr/gpmc_csn5/rmii2_rxerr) P13.2
NetBBONE1_A14: BBONE1.A14(U14/EHRPWM1A/gpmc_a2/mii_txd3/rgmii2_td3/mmc2_dat1) P14.2
NetBBONE1_A15: BBONE1.A15(R13/GPIO1_16/gpmc_a2/gmii_txen/rmii_tctl/mii2_txen) P15.2
NetBBONE1_A16: BBONE1.A16(T14/EHRPWM1B/gpmc_a3/mii2_txd/rgmii2_t2d/mmc2_dat) P16.2
NetBBONE1_A17: BBONE1.A17(A16/I2C1_SCL/spi2_cs0/mmc2_swdp/I2C1_SCL/ehrpwm0_synci) P17.2
NetBBONE1_A18: BBONE1.A18(B16/12C1_SDA/spi0_d1/mmc1_sdwp/I2C_SDA/ehrpwm0_tripzone) P18.2
NetBBONE1_A19: BBONE1.A19(D17/I2C2_SCL/uart1_rtsn/timer5/dcan0_rx/I2C2_SCL) P19.2
NetBBONE1_A20: BBONE1.A20(D18/I2C2_SDA/uart1_ctsn/timer6/dcan0_tx/I2C2_SDA) P20.2
NetBBONE1_A21: BBONE1.A21(B17/UART2_TXD/spi0_d0/uart2_txd/I2C2_SCL/ehrpwm0B) P21.2
NetBBONE1_A22: BBONE1.A22(A17/UART2_RXD/spi0_sclk/UART2_rxd/I2C2_SDA/ehrpwm0A) P22.2
NetBBONE1_A23: BBONE1.A23(V14/GPIO1_17/gpmc_a1/gmii_rx2_rxdv/rgmii2_rxdv/mmc2_dat0) P23.2
NetBBONE1_A24: BBONE1.A24(D15/UART1_TXD/uart1_txd/mmc2_sdwp/dcan1_rx/I2C1_SCL) P24.2
NetBBONE1_A25: BBONE1.A25(A14/GPIO3_21/mcasp0_ahclkx/eQEP0_strobe/mcasp0_axr3/mcasp1_axr1) P25.2
NetBBONE1_A26: BBONE1.A26(D16/UART1_RXD/uart1_rxd/mmc1_sdwp/dcan1_tx/I2C1_SDA) P26.2
NetBBONE1_A27: BBONE1.A27(C13/GPIO3_19/mcasp0_fsr/eQEP0B_in/mcasp0_axr3/mcasp1_fsx) P27.2
NetBBONE1_A28: BBONE1.A28(C12/SPI1_CS0/mcasp0_ahclkr/ehrpwm0_synci/mcasp0_axr2/spi1_cs0) P28.2
NetBBONE1_A29: BBONE1.A29(B13/SPI1_D0/mcasp0_fsx/ehrpwm0B/__/spi1_d0) P29.2
NetBBONE1_A30: BBONE1.A30(D12/SPI1_D1/mcasp0_axr0/ehrpwm0_tripzone/__/spi1_d1) P30.2
NetBBONE1_A31: BBONE1.A31(A13/SPI1_SCLK/mcasp0_aclkx/ehrpwm0A/__/spi1_sclk) P31.2
NetBBONE1_A32: BBONE1.A32(VADC) P32.2
NetBBONE1_A33: BBONE1.A33(C8/AIN4) P33.2
NetBBONE1_A34: BBONE1.A34(AGND) P34.2
NetBBONE1_A35: BBONE1.A35(A5/AIN6) P35.2
NetBBONE1_A36: BBONE1.A36(A5/AIN5) P36.2
NetBBONE1_A37: BBONE1.A37(B7/AIN2) P37.2
NetBBONE1_A38: BBONE1.A38(A7/AIN3) P38.2
NetBBONE1_A39: BBONE1.A39(B6/AIN0) P39.2
NetBBONE1_A40: BBONE1.A40(C7/AIN1) P40.2
NetBBONE1_A41: BBONE1.A41(D14/CLKOUT2/xdma_event_intr1/__/tclkin/clkout2) P41.2
NetBBONE1_A42: BBONE1.A42(C18/GPIO0_7/eCAP0_in_PWM0_out/uart3_txd/spi1_cs1/pr1_ecap0_ecap_cap_in_apwm_o) P42.2
NetBBONE1_A43: BBONE1.A43(GND) P43.2
NetBBONE1_A44: BBONE1.A44(GND) P44.2
NetBBONE1_A45: BBONE1.A45(GND) P45.2
NetBBONE1_A46: BBONE1.A46(GND) P46.2
NetBBONE1_B01: BBONE1.B01(GND) P47.2
NetBBONE1_B02: BBONE1.B02(GND) P48.2
NetBBONE1_B03: BBONE1.B03(R9/GPIO1_6) P49.2
NetBBONE1_B04: BBONE1.B04(T9/GPIO1_7) P50.2
NetBBONE1_B05: BBONE1.B05(R8/GPIO1_2) P51.2
NetBBONE1_B06: BBONE1.B06(T8/GPIO1_3) P52.2
NetBBONE1_B07: BBONE1.B07(R7/TIMER4) P53.2
NetBBONE1_B08: BBONE1.B08(T7/TIMER7) P54.2
NetBBONE1_B09: BBONE1.B09(T6/TIMER5) P55.2
NetBBONE1_B10: BBONE1.B10(U6/TIMER6) P56.2
NetBBONE1_B11: BBONE1.B11(R12/GPIO1_13) P57.2
NetBBONE1_B12: BBONE1.B12(T12/GPIO1_12) P58.2
NetBBONE1_B13: BBONE1.B13(T10/EHRPWM2B) P59.2
NetBBONE1_B14: BBONE1.B14(T11/GPIO0_26) P60.2
NetBBONE1_B15: BBONE1.B15(U13/GPIO1_15) P61.2
NetBBONE1_B16: BBONE1.B16(V13/GPIO1_14) P62.2
NetBBONE1_B17: BBONE1.B17(U12/GPIO0_27) P63.2
NetBBONE1_B18: BBONE1.B18(V12/GPIO2_1) P64.2
NetBBONE1_B19: BBONE1.B19(U10/EHRPWM2A) P65.2
NetBBONE1_B20: BBONE1.B20(V9/GPIO1_31) P66.2
NetBBONE1_B21: BBONE1.B21(U9/GPIO1_30) P67.2
NetBBONE1_B22: BBONE1.B22(V8/GPIO1_5) P68.2
NetBBONE1_B23: BBONE1.B23(U8/GPIO1_4) P69.2
NetBBONE1_B24: BBONE1.B24(V7/GPIO1_1) P70.2
NetBBONE1_B25: BBONE1.B25(U7/GPIO1_0) P71.2
NetBBONE1_B26: BBONE1.B26(V6/GPIO1_29) P72.2
NetBBONE1_B27: BBONE1.B27(U5/GPIO2_22) P73.2
NetBBONE1_B28: BBONE1.B28(V5/GPIO2_24) P74.2
NetBBONE1_B29: BBONE1.B29(R5/GPIO2_23) P75.2
NetBBONE1_B30: BBONE1.B30(R6/GPIO2_25) P76.2
NetBBONE1_B31: BBONE1.B31(V4/UART5_CTSN) P77.2
NetBBONE1_B32: BBONE1.B32(T5/UART5_RTSN) P78.2
NetBBONE1_B33: BBONE1.B33(V3/UART4_RTSN) P79.2
NetBBONE1_B34: BBONE1.B34(U4/UART3_RTSN) P80.2
NetBBONE1_B35: BBONE1.B35(V2/UART4_CTSN) P81.2
NetBBONE1_B36: BBONE1.B36(U3/UART3_CTSN) P82.2
NetBBONE1_B37: BBONE1.B37(U1/UART5_TXD) P83.2
NetBBONE1_B38: BBONE1.B38(U2/UART5_RXD) P84.2
NetBBONE1_B39: BBONE1.B39(T3/GPIO2_12) P85.2
NetBBONE1_B40: BBONE1.B40(T4/GPIO2_13) P86.2
NetBBONE1_B41: BBONE1.B41(T1/GPIO2_10) P87.2
NetBBONE1_B42: BBONE1.B42(T2/GPIO2_11) P88.2
NetBBONE1_B43: BBONE1.B43(R3/GPIO2_8) P89.2
NetBBONE1_B44: BBONE1.B44(R4/GPIO2_9) P90.2
NetBBONE1_B45: BBONE1.B45(R1/GPIO2_6) P91.2
NetBBONE1_B46: BBONE1.B46(A46/R2/GPIO2_7) P92.2
NetBBONE1_P01: BBONE1.P01(P01/BAT) P93.2
NetBBONE1_P02: BBONE1.P02(P02/BAT) P94.2
NetBBONE1_P03: BBONE1.P03(P03/BAT_TEMP) P95.2
NetBBONE1_P04: BBONE1.P04(P04/BAT_SENSE) P96.2
NetBBONE1_P05: BBONE1.P05(P05/BL_ISET2) P97.2
NetBBONE1_P06: BBONE1.P06(P06/BL_ISET1) P98.2
NetBBONE1_P07: BBONE1.P07(P07/BL_OUT) P99.2
NetBBONE1_P08: BBONE1.P08(P08/BL_IN) P100.2
NetBBONE1_P09: BBONE1.P09(P09/BL_SINK2) P101.2
NetBBONE1_P10: BBONE1.P10(P10/BL_SINK1) P102.2

Not connected (* = marked no-connect by the designer): P7 1*; P8 1*; P9 1*; P10 1*; P25 1*; P28 1*; P29 1*; P31 1*; P32 1; P33 1; P34 1; P35 1; P36 1; P37 1; P38 1; P39 1; P40 1; P41 1*; P42 1*; P73 1*; P74 1*; P75 1*; P76 1*; P77 1*; P78 1*; P79 1*; P80 1*; P81 1*; P82 1*; P83 1*; P84 1*; P85 1*; P86 1*; P87 1*; P88 1*; P89 1*; P90 1*; P91 1*; P92 1*; P93 1*; P94 1*; P95 1*; P96 1*; P97 1*; P98 1*; P99 1*; P100 1*; P101 1*; P102 1*

### Notes on the sheet
- DVI Interface

### Library data of the parts
R1 R2 = 1206 Thick Film Resistor 1%

## Sheet COMMS.SchDoc
size A4; DocumentNumber: 1; SheetNumber: 3; SheetTotal: 6
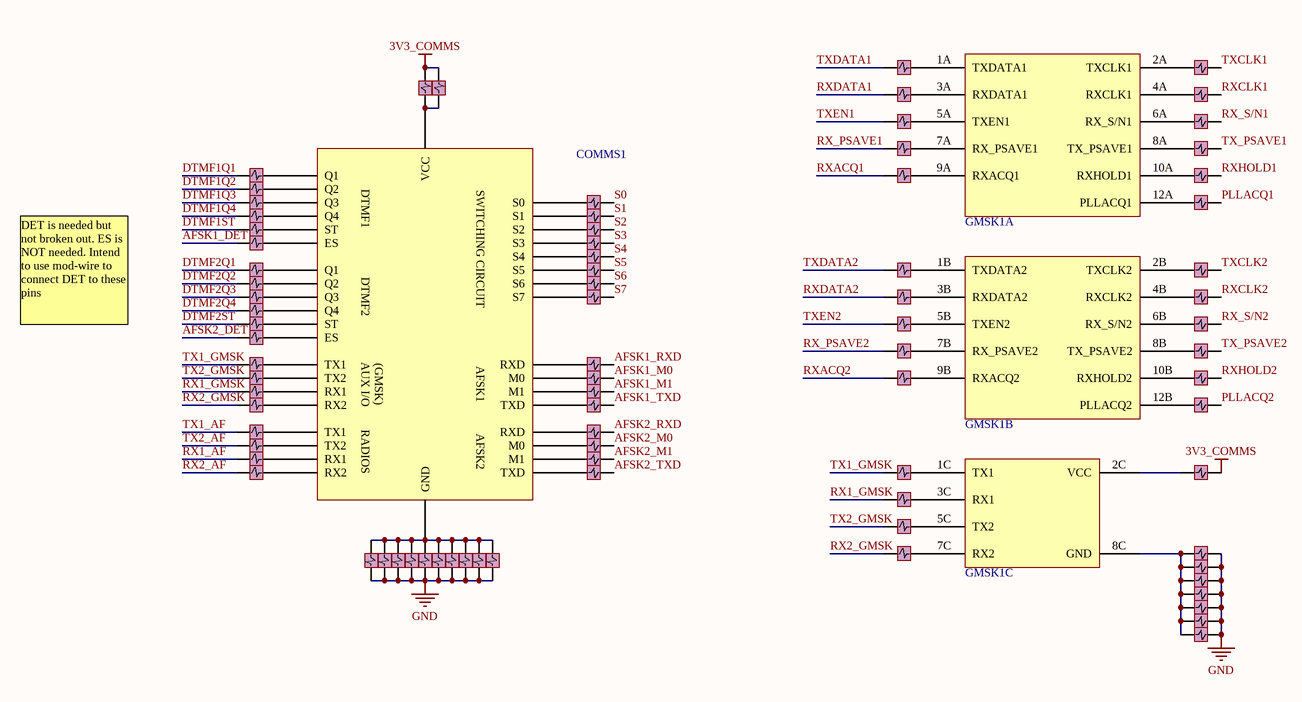
[diagram p2: COMMS.SchDoc]

### Parts
COMMS1  COMMS  [Communications]  (value not drawn)
GMSK1  GMSK  [GMSK]  (value not drawn)  (parts A,B,C of 3)
P103  Jumper_Filter  [Jumper_filter]  (value not drawn)
P104  Jumper_Filter  [Jumper_filter]  (value not drawn)
P105  Jumper_Filter  [Jumper_filter]  (value not drawn)
P106  Jumper_Filter  [Jumper_filter]  (value not drawn)
P107  Jumper_Filter  [Jumper_filter]  (value not drawn)
P108  Jumper_Filter  [Jumper_filter]  (value not drawn)
P109  Jumper_Filter  [Jumper_filter]  (value not drawn)
P110  Jumper_Filter  [Jumper_filter]  (value not drawn)
P111  Jumper_Filter  [Jumper_filter]  (value not drawn)
P112  Jumper_Filter  [Jumper_filter]  (value not drawn)
P113  Jumper_Filter  [Jumper_filter]  (value not drawn)
P114  Jumper_Filter  [Jumper_filter]  (value not drawn)
P115  Jumper_Filter  [Jumper_filter]  (value not drawn)
P116  Jumper_Filter  [Jumper_filter]  (value not drawn)
P117  Jumper_Filter  [Jumper_filter]  (value not drawn)
P118  Jumper_Filter  [Jumper_filter]  (value not drawn)
P119  Jumper_Filter  [Jumper_filter]  (value not drawn)
P120  Jumper_Filter  [Jumper_filter]  (value not drawn)
P121  Jumper_Filter  [Jumper_filter]  (value not drawn)
P122  Jumper_Filter  [Jumper_filter]  (value not drawn)
P123  Jumper_Filter  [Jumper_filter]  (value not drawn)
P123_1  Jumper_Filter  [Jumper_filter]  (value not drawn)
P124  Jumper_Filter  [Jumper_filter]  (value not drawn)
P124_1  Jumper_Filter  [Jumper_filter]  (value not drawn)
P124_2  Jumper_Filter  [Jumper_filter]  (value not drawn)
P124_3  Jumper_Filter  [Jumper_filter]  (value not drawn)
P124_4  Jumper_Filter  [Jumper_filter]  (value not drawn)
P124_5  Jumper_Filter  [Jumper_filter]  (value not drawn)
P124_6  Jumper_Filter  [Jumper_filter]  (value not drawn)
P124_7  Jumper_Filter  [Jumper_filter]  (value not drawn)
P124_8  Jumper_Filter  [Jumper_filter]  (value not drawn)
P124_9  Jumper_Filter  [Jumper_filter]  (value not drawn)
P125  Jumper_Filter  [Jumper_filter]  (value not drawn)
P126  Jumper_Filter  [Jumper_filter]  (value not drawn)
P127  Jumper_Filter  [Jumper_filter]  (value not drawn)
P128  Jumper_Filter  [Jumper_filter]  (value not drawn)
P129  Jumper_Filter  [Jumper_filter]  (value not drawn)
P130  Jumper_Filter  [Jumper_filter]  (value not drawn)
P131  Jumper_Filter  [Jumper_filter]  (value not drawn)
P132  Jumper_Filter  [Jumper_filter]  (value not drawn)
P133  Jumper_Filter  [Jumper_filter]  (value not drawn)
P134  Jumper_Filter  [Jumper_filter]  (value not drawn)
P135  Jumper_Filter  [Jumper_filter]  (value not drawn)
P136  Jumper_Filter  [Jumper_filter]  (value not drawn)
P137  Jumper_Filter  [Jumper_filter]  (value not drawn)
P138  Jumper_Filter  [Jumper_filter]  (value not drawn)
P139  Jumper_Filter  [Jumper_filter]  (value not drawn)
P140  Jumper_Filter  [Jumper_filter]  (value not drawn)
P141  Jumper_Filter  [Jumper_filter]  (value not drawn)
P142  Jumper_Filter  [Jumper_filter]  (value not drawn)
P143  Jumper_Filter  [Jumper_filter]  (value not drawn)
P144  Jumper_Filter  [Jumper_filter]  (value not drawn)
P145  Jumper_Filter  [Jumper_filter]  (value not drawn)
P146  Jumper_Filter  [Jumper_filter]  (value not drawn)
P147  Jumper_Filter  [Jumper_filter]  (value not drawn)
P148  Jumper_Filter  [Jumper_filter]  (value not drawn)
P149  Jumper_Filter  [Jumper_filter]  (value not drawn)
P150  Jumper_Filter  [Jumper_filter]  (value not drawn)
P151  Jumper_Filter  [Jumper_filter]  (value not drawn)
P152  Jumper_Filter  [Jumper_filter]  (value not drawn)
P153  Jumper_Filter  [Jumper_filter]  (value not drawn)
P154  Jumper_Filter  [Jumper_filter]  (value not drawn)
P155  Jumper_Filter  [Jumper_filter]  (value not drawn)
P156  Jumper_Filter  [Jumper_filter]  (value not drawn)
P157  Jumper_Filter  [Jumper_filter]  (value not drawn)
P158  Jumper_Filter  [Jumper_filter]  (value not drawn)
P159  Jumper_Filter  [Jumper_filter]  (value not drawn)
P160  Jumper_Filter  [Jumper_filter]  (value not drawn)
P161  Jumper_Filter  [Jumper_filter]  (value not drawn)
P162  Jumper_Filter  [Jumper_filter]  (value not drawn)
P163  Jumper_Filter  [Jumper_filter]  (value not drawn)
P164  Jumper_Filter  [Jumper_filter]  (value not drawn)
P165  Jumper_Filter  [Jumper_filter]  (value not drawn)
P166  Jumper_Filter  [Jumper_filter]  (value not drawn)
P167  Jumper_Filter  [Jumper_filter]  (value not drawn)
P168  Jumper_Filter  [Jumper_filter]  (value not drawn)
P168_1  Jumper_Filter  [Jumper_filter]  (value not drawn)
P168_2  Jumper_Filter  [Jumper_filter]  (value not drawn)
P168_3  Jumper_Filter  [Jumper_filter]  (value not drawn)
P168_4  Jumper_Filter  [Jumper_filter]  (value not drawn)
P168_5  Jumper_Filter  [Jumper_filter]  (value not drawn)
P168_6  Jumper_Filter  [Jumper_filter]  (value not drawn)

### Nets
3V3_COMMS: P123.1 P123_1.1 P167.1
GND: P103.3 P104.3 P105.3 P106.3 P107.3 P108.3 P109.3 P110.3 P111.3 P112.3 P113.3 P114.3 P115.3 P116.3 P117.3 P118.3 P119.3 P120.3 P121.3 P122.3 P123.3 P123_1.3 P124.1 P124.3 P124_1.1 P124_1.3 P124_2.1 P124_2.3 P124_3.1 P124_3.3 P124_4.1 P124_4.3 P124_5.1 P124_5.3 P124_6.1 P124_6.3 P124_7.1 P124_7.3 P124_8.1 P124_8.3 P124_9.1 P124_9.3 P125.3 P126.3 P127.3 P128.3 P129.3 P130.3 P131.3 P132.3 P133.3 P134.3 P135.3 P136.3 P137.3 P138.3 P139.3 P140.3 P141.3 P142.3 P143.3 P144.3 P145.3 P146.3 P147.3 P148.3 P149.3 P150.3 P151.3 P152.3 P153.3 P154.3 P155.3 P156.3 P157.3 P158.3 P159.3 P160.3 P161.3 P162.3 P163.3 P164.3 P165.3 P166.3 P167.3 P168.1 P168.3 P168_1.1 P168_1.3 P168_2.1 P168_2.3 P168_3.1 P168_3.3 P168_4.1 P168_4.3 P168_5.1 P168_5.3 P168_6.1 P168_6.3
AFSK1_DET: P108.1
AFSK1_M0: P134.1
AFSK1_M1: P135.1
AFSK1_RXD: P133.1
AFSK1_TXD: P136.1
AFSK2_DET: P114.1
AFSK2_M0: P138.1
AFSK2_M1: P139.1
AFSK2_RXD: P137.1
AFSK2_TXD: P140.1
DTMF1Q1: P103.1
DTMF1Q2: P104.1
DTMF1Q3: P105.1
DTMF1Q4: P106.1
DTMF1ST: P107.1
DTMF2Q1: P109.1
DTMF2Q2: P110.1
DTMF2Q3: P111.1
DTMF2Q4: P112.1
DTMF2ST: P113.1
PLLACQ1: P160.1
PLLACQ2: P166.1
RX1_AF: P121.1
RX1_GMSK: P117.1 P152.1
RX2_AF: P122.1
RX2_GMSK: P118.1 P154.1
RX_PSAVE1: P144.1
RX_PSAVE2: P149.1
RX_S/N1: P157.1
RX_S/N2: P163.1
RXACQ1: P145.1
RXACQ2: P150.1
RXCLK1: P156.1
RXCLK2: P162.1
RXDATA1: P142.1
RXDATA2: P147.1
RXHOLD1: P159.1
RXHOLD2: P165.1
S0: P125.1
S1: P126.1
S2: P127.1
S3: P128.1
S4: P129.1
S5: P130.1
S6: P131.1
S7: P132.1
TX1_AF: P119.1
TX1_GMSK: P115.1 P151.1
TX2_AF: P120.1
TX2_GMSK: P116.1 P153.1
TX_PSAVE1: P158.1
TX_PSAVE2: P164.1
TXCLK1: P155.1
TXCLK2: P161.1
TXDATA1: P141.1
TXDATA2: P146.1
TXEN1: P143.1
TXEN2: P148.1
NetCOMMS1_AFSK1_M0: COMMS1.AFSK1_M0(M0) P134.2
NetCOMMS1_AFSK1_M1: COMMS1.AFSK1_M1(M1) P135.2
NetCOMMS1_AFSK1_RXD: COMMS1.AFSK1_RXD(RXD) P133.2
NetCOMMS1_AFSK1_TXD: COMMS1.AFSK1_TXD(TXD) P136.2
NetCOMMS1_AFSK2_M0: COMMS1.AFSK2_M0(M0) P138.2
NetCOMMS1_AFSK2_M1: COMMS1.AFSK2_M1(M1) P139.2
NetCOMMS1_AFSK2_RXD: COMMS1.AFSK2_RXD(RXD) P137.2
NetCOMMS1_AFSK2_TXD: COMMS1.AFSK2_TXD(TXD) P140.2
NetCOMMS1_DTMF1_ES: COMMS1.DTMF1_ES(ES) P108.2
NetCOMMS1_DTMF1_Q1: COMMS1.DTMF1_Q1(Q1) P103.2
NetCOMMS1_DTMF1_Q2: COMMS1.DTMF1_Q2(Q2) P104.2
NetCOMMS1_DTMF1_Q3: COMMS1.DTMF1_Q3(Q3) P105.2
NetCOMMS1_DTMF1_Q4: COMMS1.DTMF1_Q4(Q4) P106.2
NetCOMMS1_DTMF1_ST: COMMS1.DTMF1_ST(ST) P107.2
NetCOMMS1_DTMF2_ES: COMMS1.DTMF2_ES(ES) P114.2
NetCOMMS1_DTMF2_Q1: COMMS1.DTMF2_Q1(Q1) P109.2
NetCOMMS1_DTMF2_Q2: COMMS1.DTMF2_Q2(Q2) P110.2
NetCOMMS1_DTMF2_Q3: COMMS1.DTMF2_Q3(Q3) P111.2
NetCOMMS1_DTMF2_Q4: COMMS1.DTMF2_Q4(Q4) P112.2
NetCOMMS1_DTMF2_ST: COMMS1.DTMF2_ST(ST) P113.2
NetCOMMS1_GMSK_RX1: COMMS1.GMSK_RX1(RX1) P117.2
NetCOMMS1_GMSK_RX2: COMMS1.GMSK_RX2(RX2) P118.2
NetCOMMS1_GMSK_TX1: COMMS1.GMSK_TX1(TX1) P115.2
NetCOMMS1_GMSK_TX2: COMMS1.GMSK_TX2(TX2) P116.2
NetCOMMS1_GND: COMMS1.GND P124.2 P124_1.2 P124_2.2 P124_3.2 P124_4.2 P124_5.2 P124_6.2 P124_7.2 P124_8.2 P124_9.2
NetCOMMS1_RX1: COMMS1.RX1 P121.2
NetCOMMS1_RX2: COMMS1.RX2 P122.2
NetCOMMS1_S0: COMMS1.S0 P125.2
NetCOMMS1_S1: COMMS1.S1 P126.2
NetCOMMS1_S2: COMMS1.S2 P127.2
NetCOMMS1_S3: COMMS1.S3 P128.2
NetCOMMS1_S4: COMMS1.S4 P129.2
NetCOMMS1_S5: COMMS1.S5 P130.2
NetCOMMS1_S6: COMMS1.S6 P131.2
NetCOMMS1_S7: COMMS1.S7 P132.2
NetCOMMS1_TX1: COMMS1.TX1 P119.2
NetCOMMS1_TX2: COMMS1.TX2 P120.2
NetCOMMS1_VCC: COMMS1.VCC P123.2 P123_1.2
NetGMSK1_1A: GMSK1.1A(TXDATA1) P141.2
NetGMSK1_1B: GMSK1.1B(TXDATA2) P146.2
NetGMSK1_1C: GMSK1.1C(TX1) P151.2
NetGMSK1_2A: GMSK1.2A(TXCLK1) P155.2
NetGMSK1_2B: GMSK1.2B(TXCLK2) P161.2
NetGMSK1_2C: GMSK1.2C(VCC) P167.2
NetGMSK1_3A: GMSK1.3A(RXDATA1) P142.2
NetGMSK1_3B: GMSK1.3B(RXDATA2) P147.2
NetGMSK1_3C: GMSK1.3C(RX1) P152.2
NetGMSK1_4A: GMSK1.4A(RXCLK1) P156.2
NetGMSK1_4B: GMSK1.4B(RXCLK2) P162.2
NetGMSK1_5A: GMSK1.5A(TXEN1) P143.2
NetGMSK1_5B: GMSK1.5B(TXEN2) P148.2
NetGMSK1_5C: GMSK1.5C(TX2) P153.2
NetGMSK1_6A: GMSK1.6A(RX_S/N1) P157.2
NetGMSK1_6B: GMSK1.6B(RX_S/N2) P163.2
NetGMSK1_7A: GMSK1.7A(RX_PSAVE1) P144.2
NetGMSK1_7B: GMSK1.7B(RX_PSAVE2) P149.2
NetGMSK1_7C: GMSK1.7C(RX2) P154.2
NetGMSK1_8A: GMSK1.8A(TX_PSAVE1) P158.2
NetGMSK1_8B: GMSK1.8B(TX_PSAVE2) P164.2
NetGMSK1_8C: GMSK1.8C(GND) P168.2 P168_1.2 P168_2.2 P168_3.2 P168_4.2 P168_5.2 P168_6.2
NetGMSK1_9A: GMSK1.9A(RXACQ1) P145.2
NetGMSK1_9B: GMSK1.9B(RXACQ2) P150.2
NetGMSK1_10A: GMSK1.10A(RXHOLD1) P159.2
NetGMSK1_10B: GMSK1.10B(RXHOLD2) P165.2
NetGMSK1_12A: GMSK1.12A(PLLACQ1) P160.2
NetGMSK1_12B: GMSK1.12B(PLLACQ2) P166.2

### Notes on the sheet
- DET is needed but not broken out. ES is NOT needed. Intend to use mod-wire to connect DET to these pins
- (in symbol COMMS) DTMF1; SWITCHING CIRCUIT; DTMF2; AUX I/O; (GMSK); AFSK1; RADIOS; AFSK2

### Library data of the parts
COMMS1 = COMMS: ClassName: COMMSB
GMSK1 = GMSK: ClassName: GMSK
P103-P123 P123_1 P124 P124_1-P124_9 P125-P168 P168_1-P168_6 = Jumper_Filter
  P103-P123 P123_1 P124 P124_1-P124_9 P125-P140: ClassName: COMMSB
  P141-P168 P168_1-P168_6: ClassName: GMSK

## Sheet PWR_GEN.SchDoc
size A4; DocumentNumber: 1; SheetNumber: 4; SheetTotal: 6
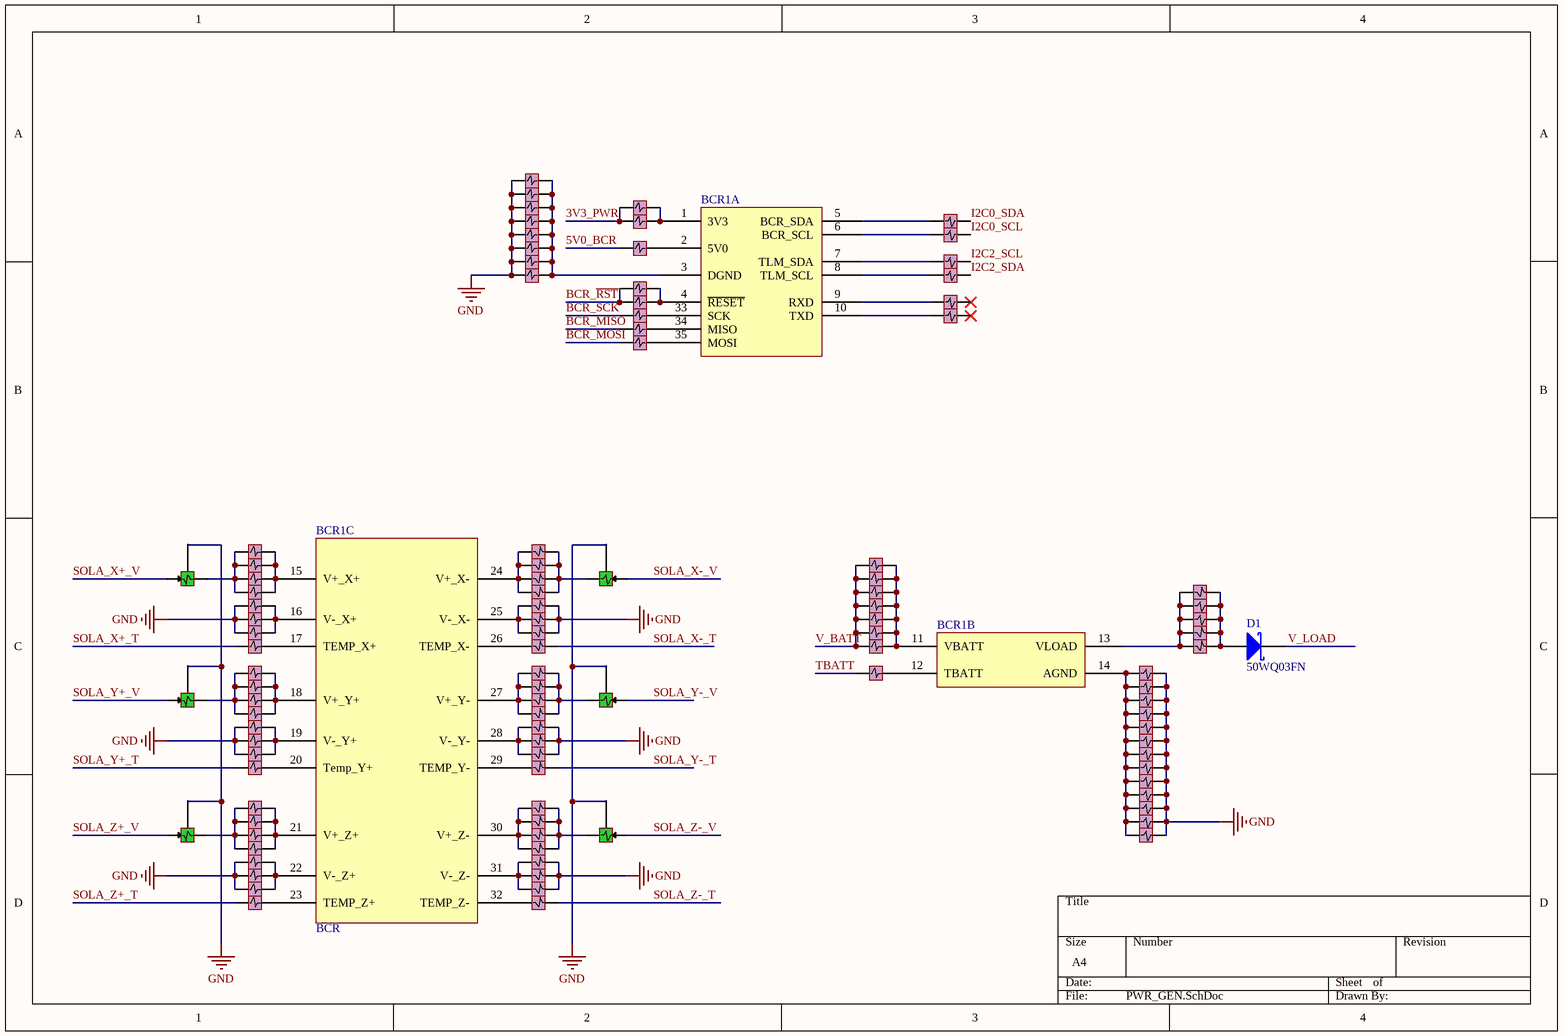
[diagram p3: PWR_GEN.SchDoc]

### Parts
BCR1  BCR  [BCR]  (value not drawn)  (parts A,B,C of 3)
D1  50WQ03FN  [TO229P990X238-3N]
F15  FilterSola  [FILTERSOLA]  (value not drawn)
F16  FilterSola  [FILTERSOLA]  (value not drawn)
F17  FilterSola  [FILTERSOLA]  (value not drawn)
F18  FilterSola  [FILTERSOLA]  (value not drawn)
F19  FilterSola  [FILTERSOLA]  (value not drawn)
F20  FilterSola  [FILTERSOLA]  (value not drawn)
P337  Jumper_Filter  [Jumper_filter]  (value not drawn)
P338  Jumper_Filter  [Jumper_filter]  (value not drawn)
P339  Jumper_Filter  [Jumper_filter]  (value not drawn)
P340  Jumper_Filter  [Jumper_filter]  (value not drawn)
P341  Jumper_Filter  [Jumper_filter]  (value not drawn)
P342  Jumper_Filter  [Jumper_filter]  (value not drawn)
P343  Jumper_Filter  [Jumper_filter]  (value not drawn)
P344  Jumper_Filter  [Jumper_filter]  (value not drawn)
P345  Jumper_Filter  [Jumper_filter]  (value not drawn)
P346  Jumper_Filter  [Jumper_filter]  (value not drawn)
P347  Jumper_Filter  [Jumper_filter]  (value not drawn)
P348  Jumper_Filter  [Jumper_filter]  (value not drawn)
P349  Jumper_Filter  [Jumper_filter]  (value not drawn)
P350  Jumper_Filter  [Jumper_filter]  (value not drawn)
P351  Jumper_Filter  [Jumper_filter]  (value not drawn)
P352  Jumper_Filter  [Jumper_filter]  (value not drawn)
P353  Jumper_Filter  [Jumper_filter]  (value not drawn)
P354  Jumper_Filter  [Jumper_filter]  (value not drawn)
P355  Jumper_Filter  [Jumper_filter]  (value not drawn)
P356  Jumper_Filter  [Jumper_filter]  (value not drawn)
P357  Jumper_Filter  [Jumper_filter]  (value not drawn)
P358  Jumper_Filter  [Jumper_filter]  (value not drawn)
P359  Jumper_Filter  [Jumper_filter]  (value not drawn)
P360  Jumper_Filter  [Jumper_filter]  (value not drawn)
P361  Jumper_Filter  [Jumper_filter]  (value not drawn)
P362  Jumper_Filter  [Jumper_filter]  (value not drawn)
P363  Jumper_Filter  [Jumper_filter]  (value not drawn)
P364  Jumper_Filter  [Jumper_filter]  (value not drawn)
P365  Jumper_Filter  [Jumper_filter]  (value not drawn)
P366  Jumper_Filter  [Jumper_filter]  (value not drawn)
P367  Jumper_Filter  [Jumper_filter]  (value not drawn)
P368  Jumper_Filter  [Jumper_filter]  (value not drawn)
P369  Jumper_Filter  [Jumper_filter]  (value not drawn)
P370  Jumper_Filter  [Jumper_filter]  (value not drawn)
P371  Jumper_Filter  [Jumper_filter]  (value not drawn)
P372  Jumper_Filter  [Jumper_filter]  (value not drawn)
P373  Jumper_Filter  [Jumper_filter]  (value not drawn)
P374  Jumper_Filter  [Jumper_filter]  (value not drawn)
P375  Jumper_Filter  [Jumper_filter]  (value not drawn)
P376  Jumper_Filter  [Jumper_filter]  (value not drawn)
P377  Jumper_Filter  [Jumper_filter]  (value not drawn)
P378  Jumper_Filter  [Jumper_filter]  (value not drawn)
P379  Jumper_Filter  [Jumper_filter]  (value not drawn)
P380  Jumper_Filter  [Jumper_filter]  (value not drawn)
P381  Jumper_Filter  [Jumper_filter]  (value not drawn)
P382  Jumper_Filter  [Jumper_filter]  (value not drawn)
P383  Jumper_Filter  [Jumper_filter]  (value not drawn)
P384  Jumper_Filter  [Jumper_filter]  (value not drawn)
P385  Jumper_Filter  [Jumper_filter]  (value not drawn)
P386  Jumper_Filter  [Jumper_filter]  (value not drawn)
P387  Jumper_Filter  [Jumper_filter]  (value not drawn)
P388  Jumper_Filter  [Jumper_filter]  (value not drawn)
P389  Jumper_Filter  [Jumper_filter]  (value not drawn)
P390  Jumper_Filter  [Jumper_filter]  (value not drawn)
P391  Jumper_Filter  [Jumper_filter]  (value not drawn)
P392  Jumper_Filter  [Jumper_filter]  (value not drawn)
P393  Jumper_Filter  [Jumper_filter]  (value not drawn)
P394  Jumper_Filter  [Jumper_filter]  (value not drawn)
P395  Jumper_Filter  [Jumper_filter]  (value not drawn)
P396  Jumper_Filter  [Jumper_filter]  (value not drawn)
P397  Jumper_Filter  [Jumper_filter]  (value not drawn)
P398  Jumper_Filter  [Jumper_filter]  (value not drawn)
P399  Jumper_Filter  [Jumper_filter]  (value not drawn)
P400  Jumper_Filter  [Jumper_filter]  (value not drawn)
P401  Jumper_Filter  [Jumper_filter]  (value not drawn)
P402  Jumper_Filter  [Jumper_filter]  (value not drawn)
P403  Jumper_Filter  [Jumper_filter]  (value not drawn)
P404  Jumper_Filter  [Jumper_filter]  (value not drawn)
P405  Jumper_Filter  [Jumper_filter]  (value not drawn)
P406  Jumper_Filter  [Jumper_filter]  (value not drawn)
P407  Jumper_Filter  [Jumper_filter]  (value not drawn)
P408  Jumper_Filter  [Jumper_filter]  (value not drawn)
P409  Jumper_Filter  [Jumper_filter]  (value not drawn)
P410  Jumper_Filter  [Jumper_filter]  (value not drawn)
P411  Jumper_Filter  [Jumper_filter]  (value not drawn)
P412  Jumper_Filter  [Jumper_filter]  (value not drawn)
P413  Jumper_Filter  [Jumper_filter]  (value not drawn)
P414  Jumper_Filter  [Jumper_filter]  (value not drawn)
P415  Jumper_Filter  [Jumper_filter]  (value not drawn)
P416  Jumper_Filter  [Jumper_filter]  (value not drawn)
P417  Jumper_Filter  [Jumper_filter]  (value not drawn)
P418  Jumper_Filter  [Jumper_filter]  (value not drawn)
P419  Jumper_Filter  [Jumper_filter]  (value not drawn)
P420  Jumper_Filter  [Jumper_filter]  (value not drawn)
P421  Jumper_Filter  [Jumper_filter]  (value not drawn)
P422  Jumper_Filter  [Jumper_filter]  (value not drawn)
P423  Jumper_Filter  [Jumper_filter]  (value not drawn)
P424  Jumper_Filter  [Jumper_filter]  (value not drawn)
P425  Jumper_Filter  [Jumper_filter]  (value not drawn)
P426  Jumper_Filter  [Jumper_filter]  (value not drawn)
P427  Jumper_Filter  [Jumper_filter]  (value not drawn)
P428  Jumper_Filter  [Jumper_filter]  (value not drawn)
P429  Jumper_Filter  [Jumper_filter]  (value not drawn)
P430  Jumper_Filter  [Jumper_filter]  (value not drawn)
P431  Jumper_Filter  [Jumper_filter]  (value not drawn)
P432  Jumper_Filter  [Jumper_filter]  (value not drawn)

### Nets
3V3_PWR: P393.1 P394.1
GND: F15.3 F16.3 F17.3 F18.3 F19.3 F20.3 P337.3 P338.3 P339.3 P340.3 P341.1 P341.3 P342.1 P342.3 P343.1 P343.3 P344.3 P345.3 P346.3 P347.3 P348.3 P349.1 P349.3 P350.1 P350.3 P351.1 P351.3 P352.3 P353.3 P354.3 P355.3 P356.3 P357.1 P357.3 P358.1 P358.3 P359.1 P359.3 P360.3 P361.1 P361.3 P362.1 P362.3 P363.1 P363.3 P364.1 P364.3 P365.1 P365.3 P366.1 P366.3 P367.1 P367.3 P368.1 P368.3 P369.3 P370.3 P371.3 P372.3 P373.1 P373.3 P374.1 P374.3 P375.1 P375.3 P376.3 P377.3 P378.3 P379.3 P380.3 P381.1 P381.3 P382.1 P382.3 P383.1 P383.3 P384.3 P385.3 P386.3 P387.3 P388.3 P389.1 P389.3 P390.1 P390.3 P391.1 P391.3 P392.3 P393.3 P394.3 P395.3 P396.3 P397.3 P398.3 P399.3 P400.3 P401.3 P402.3 P403.3 P404.3 P405.3 P406.3 P407.3 P408.3 P409.3 P410.3 P411.3 P412.3 P413.3 P414.3 P415.1 P415.3 P416.1 P416.3 P417.1 P417.3 P418.1 P418.3 P419.1 P419.3 P420.1 P420.3 P421.1 P421.3 P422.1 P422.3 P423.1 P423.3 P424.1 P424.3 P425.1 P425.3 P426.1 P426.3 P427.1 P427.3 P428.3 P429.3 P430.3 P431.3 P432.3
V_BATT: P401.1 P402.1 P403.1 P404.1 P405.1 P406.1 P407.1
V_LOAD: D1.2(K)
5V0_BCR: P395.1
BCR_MISO: P399.1
BCR_MOSI: P400.1
BCR_~{RST}: P396.1 P397.1
BCR_SCK: P398.1
I2C0_SCL: P410.1
I2C0_SDA: P409.1
I2C2_SCL: P411.1
I2C2_SDA: P412.1
SOLA_X+_T: P344.1
SOLA_X+_V: F15.1
SOLA_X-_T: P376.1
SOLA_X-_V: F18.1
SOLA_Y+_T: P352.1
SOLA_Y+_V: F16.1
SOLA_Y-_T: P384.1
SOLA_Y-_V: F19.1
SOLA_Z+_T: P360.1
SOLA_Z+_V: F17.1
SOLA_Z-_T: P392.1
SOLA_Z-_V: F20.1
TBATT: P408.1
NetBCR1_1: BCR1.1(3V3) P393.2 P394.2
NetBCR1_2: BCR1.2(5V0) P395.2
NetBCR1_3: BCR1.3(DGND) P361.2 P362.2 P363.2 P364.2 P365.2 P366.2 P367.2 P368.2
NetBCR1_4: BCR1.4(~{RESET}) P396.2 P397.2
NetBCR1_5: BCR1.5(BCR_SDA) P409.2
NetBCR1_6: BCR1.6(BCR_SCL) P410.2
NetBCR1_7: BCR1.7(TLM_SDA) P411.2
NetBCR1_8: BCR1.8(TLM_SCL) P412.2
NetBCR1_9: BCR1.9(RXD) P413.2
NetBCR1_10: BCR1.10(TXD) P414.2
NetBCR1_11: BCR1.11(VBATT) P401.2 P402.2 P403.2 P404.2 P405.2 P406.2 P407.2
NetBCR1_12: BCR1.12(TBATT) P408.2
NetBCR1_13: BCR1.13(VLOAD) P428.2 P429.2 P430.2 P431.2 P432.2
NetBCR1_14: BCR1.14(AGND) P415.2 P416.2 P417.2 P418.2 P419.2 P420.2 P421.2 P422.2 P423.2 P424.2 P425.2 P426.2 P427.2
NetBCR1_15: BCR1.15(V+_X+) P337.2 P338.2 P339.2 P340.2
NetBCR1_16: BCR1.16(V-_X+) P341.2 P342.2 P343.2
NetBCR1_17: BCR1.17(TEMP_X+) P344.2
NetBCR1_18: BCR1.18(V+_Y+) P345.2 P346.2 P347.2 P348.2
NetBCR1_19: BCR1.19(V-_Y+) P349.2 P350.2 P351.2
NetBCR1_20: BCR1.20(Temp_Y+) P352.2
NetBCR1_21: BCR1.21(V+_Z+) P353.2 P354.2 P355.2 P356.2
NetBCR1_22: BCR1.22(V-_Z+) P357.2 P358.2 P359.2
NetBCR1_23: BCR1.23(TEMP_Z+) P360.2
NetBCR1_24: BCR1.24(V+_X-) P369.2 P370.2 P371.2 P372.2
NetBCR1_25: BCR1.25(V-_X-) P373.2 P374.2 P375.2
NetBCR1_26: BCR1.26(TEMP_X-) P376.2
NetBCR1_27: BCR1.27(V+_Y-) P377.2 P378.2 P379.2 P380.2
NetBCR1_28: BCR1.28(V-_Y-) P381.2 P382.2 P383.2
NetBCR1_29: BCR1.29(TEMP_Y-) P384.2
NetBCR1_30: BCR1.30(V+_Z-) P385.2 P386.2 P387.2 P388.2
NetBCR1_31: BCR1.31(V-_Z-) P389.2 P390.2 P391.2
NetBCR1_32: BCR1.32(TEMP_Z-) P392.2
NetBCR1_33: BCR1.33(SCK) P398.2
NetBCR1_34: BCR1.34(MISO) P399.2
NetBCR1_35: BCR1.35(MOSI) P400.2
NetD1_1: D1.1(A) P428.1 P429.1 P430.1 P431.1 P432.1
NetF15_2: F15.2 P337.1 P338.1 P339.1 P340.1
NetF16_2: F16.2 P345.1 P346.1 P347.1 P348.1
NetF17_2: F17.2 P353.1 P354.1 P355.1 P356.1
NetF18_2: F18.2 P369.1 P370.1 P371.1 P372.1
NetF19_2: F19.2 P377.1 P378.1 P379.1 P380.1
NetF20_2: F20.2 P385.1 P386.1 P387.1 P388.1

Not connected (* = marked no-connect by the designer): P413 1*; P414 1*

### Library data of the parts
D1 = D Schottky: Schottky Diode; Published: 8-Jun-2000; LatestRevisionDate: 17-Jul-2002; LatestRevisionNote: Re-released for DXP Platform.; PackageReference: SMB; Publisher: Altium Limited; PackageDescription: DO-214-AA/SMB; 2 C-Bend Leads; Body 5.3 x 3.6 mm, inc. leads (LxW); Code_JEDEC: DO-214-AA